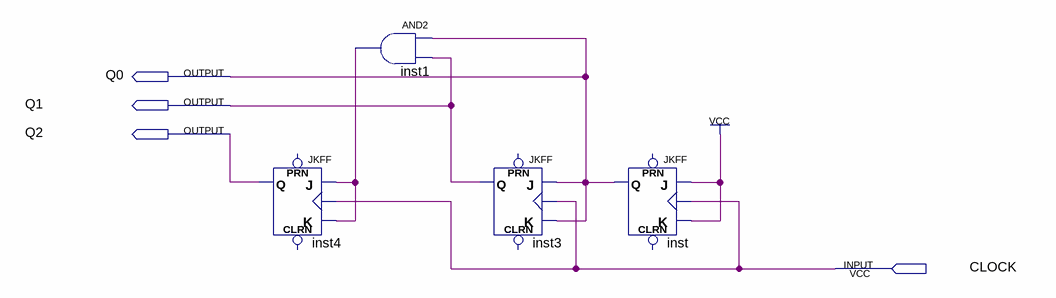
[diagram p0: schematic sheet]
// Quartus schematic ex4-lista3.bdf as structural Verilog: 4 symbols, 4 pins
module \ex4-lista3  (
  input  CLOCK,
  output Q0,
  output Q1,
  output Q2
);

  wire inst1_out;

  JKFF inst4 (.K(inst1_out), .J(inst1_out), .CLK(CLOCK), .Q(Q2));  // open: PRN, CLRN
  and inst1 (inst1_out, Q0, Q1);
  JKFF inst3 (.K(Q0), .J(Q0), .CLK(CLOCK), .Q(Q1));  // open: PRN, CLRN
  JKFF inst (.K(1'b1), .J(1'b1), .CLK(CLOCK), .Q(Q0));  // open: PRN, CLRN
endmodule
